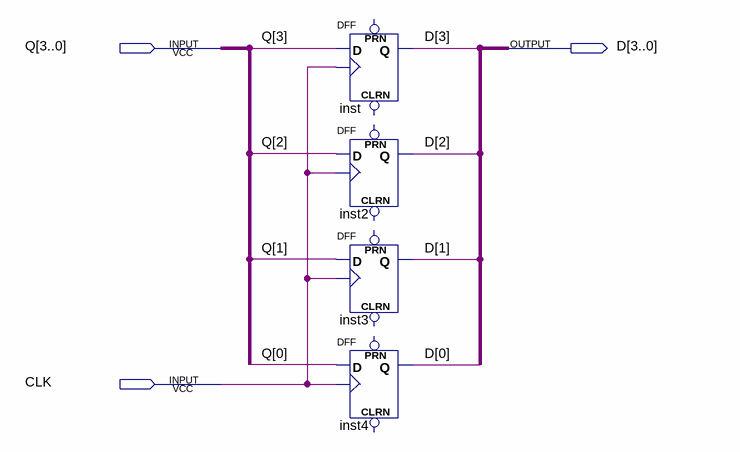
[diagram p0: schematic sheet]
// Quartus schematic Registro.bdf as structural Verilog: 4 symbols, 3 pins
module Registro (
  input  [3:0] Q,
  input  CLK,
  output [3:0] D
);

  DFF inst (.CLK(CLK), .D(Q[3]), .Q(D[3]));  // open: CLRN, PRN
  DFF inst2 (.CLK(CLK), .D(Q[2]), .Q(D[2]));  // open: CLRN, PRN
  DFF inst3 (.CLK(CLK), .D(Q[1]), .Q(D[1]));  // open: CLRN, PRN
  DFF inst4 (.CLK(CLK), .D(Q[0]), .Q(D[0]));  // open: CLRN, PRN
endmodule
